# Altium schematic sheet main.SchDoc: WULPUS PRO
size A4; CompanyName: ETH Zurich; DrawnBy: Sergei Vostrikov; Organization: Integrated Systems Laboratory; Revision: 1.0.0; SheetNumber: 1; SheetTotal: 8
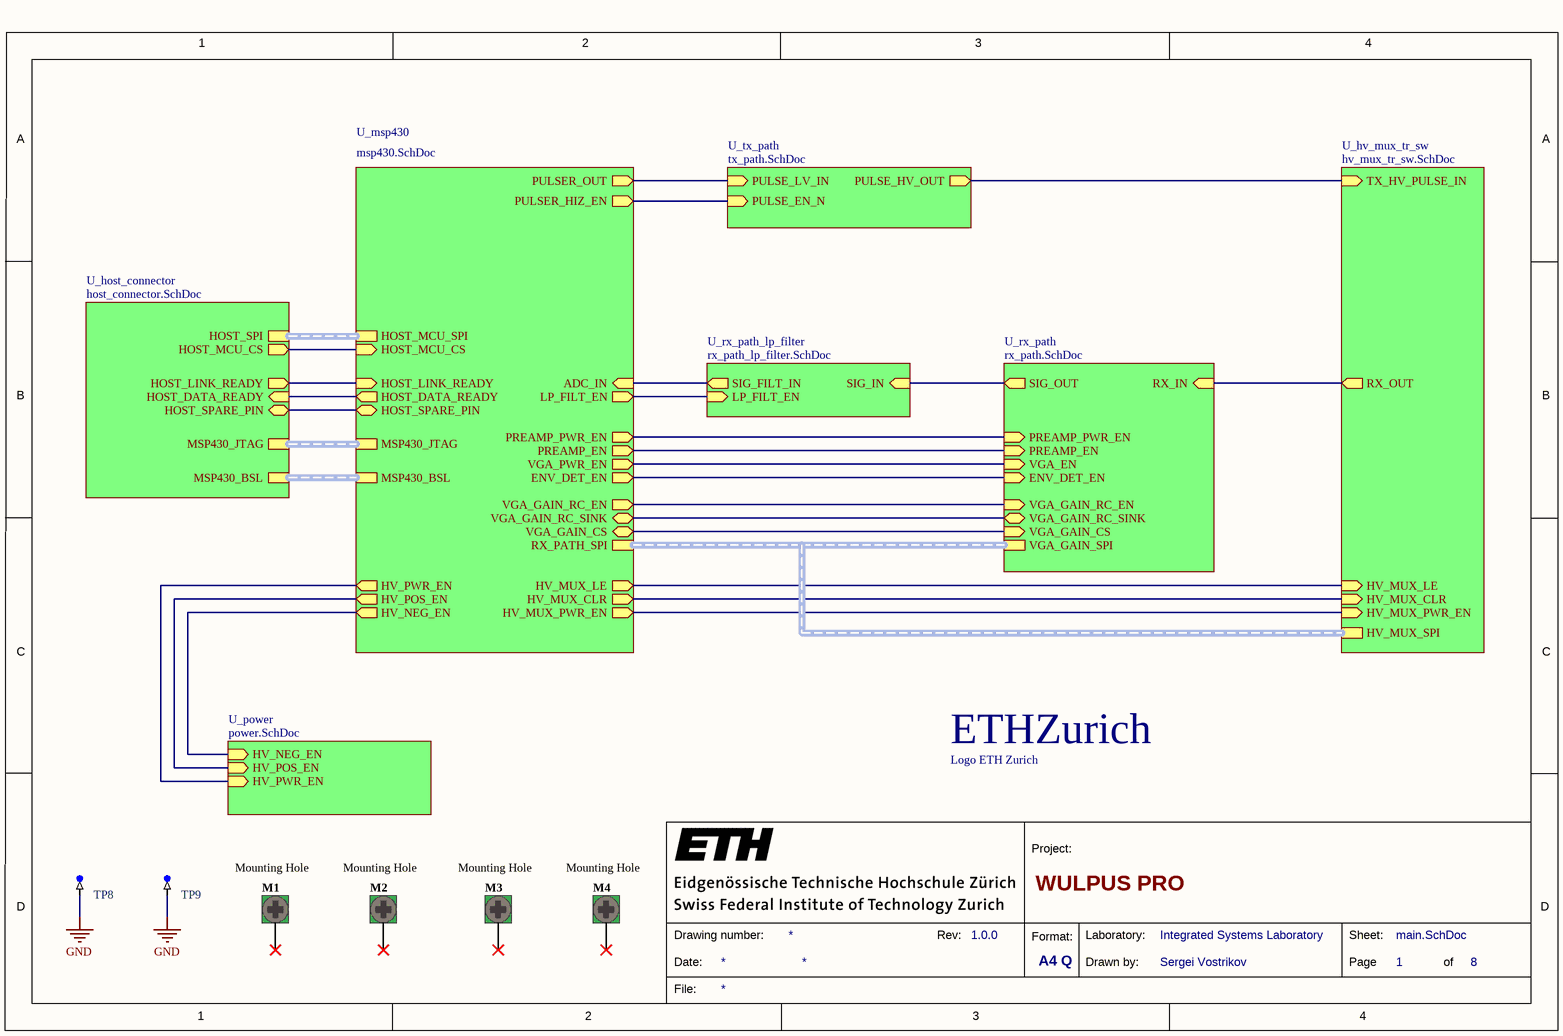
[diagram p0: main.SchDoc]

## Parts
A1  Logo ETH Zurich  [eth-zurich_3mm]  (no BOM)
M1  Mounting Hole  [Mounting Hole]  (no BOM)
M2  Mounting Hole  [Mounting Hole]  (no BOM)
M3  Mounting Hole  [Mounting Hole]  (no BOM)
M4  Mounting Hole  [Mounting Hole]  (no BOM)
TP8  TP-SM-C-100  [TP-SM-C-100]  (value not drawn)  (no BOM)
TP9  TP-SM-C-100  [TP-SM-C-100]  (value not drawn)  (no BOM)

## Sub-sheets
U_host_connector = host_connector.SchDoc: HOST_SPI (harness SPI), HOST_MCU_CS (out), HOST_DATA_READY (in), HOST_LINK_READY (out), HOST_SPARE_PIN (bidir), MSP430_JTAG (harness JTAG), MSP430_BSL (harness BSL_UART)
U_hv_mux_tr_sw = hv_mux_tr_sw.SchDoc: HV_MUX_SPI (harness SPI), HV_MUX_LE (in), HV_MUX_CLR (in), RX_OUT (out), HV_MUX_PWR_EN (in), TX_HV_PULSE_IN (in)
U_msp430 = msp430.SchDoc: ADC_IN (in), PULSER_OUT (out), RX_PATH_SPI (harness SPI), HV_MUX_CLR (out), HV_MUX_LE (out), PREAMP_PWR_EN (out), HOST_DATA_READY (out), HV_MUX_PWR_EN (out), HV_POS_EN (out), HV_NEG_EN (out), HV_PWR_EN (out), HOST_MCU_SPI (harness SPI), HOST_LINK_READY (in), VGA_PWR_EN (out), ENV_DET_EN (out), PULSER_HIZ_EN (out), VGA_GAIN_RC_EN (out), VGA_GAIN_RC_SINK (bidir), VGA_GAIN_CS (bidir), PREAMP_EN (out), HOST_MCU_CS (in), HOST_SPARE_PIN (bidir), MSP430_JTAG (harness JTAG), LP_FILT_EN (out), MSP430_BSL (harness BSL_UART)
U_power = power.SchDoc: HV_PWR_EN (in), HV_POS_EN (in), HV_NEG_EN (in)
U_rx_path = rx_path.SchDoc: VGA_GAIN_RC_EN (in), VGA_GAIN_RC_SINK (bidir), RX_IN (in), SIG_OUT (out), VGA_GAIN_SPI (harness SPI), VGA_GAIN_CS (in), ENV_DET_EN (in), VGA_EN (in), PREAMP_EN (in), PREAMP_PWR_EN (in)
U_rx_path_lp_filter = rx_path_lp_filter.SchDoc: LP_FILT_EN (in), SIG_IN (in), SIG_FILT_IN (out)
U_tx_path = tx_path.SchDoc: PULSE_EN_N (in), PULSE_LV_IN (in), PULSE_HV_OUT (out)

## Nets
GND: TP8.1 TP9.1
(unnamed): sheet U_rx_path/VGA_GAIN_RC_EN, sheet U_msp430/VGA_GAIN_RC_EN
(unnamed): sheet U_rx_path/VGA_GAIN_RC_SINK, sheet U_msp430/VGA_GAIN_RC_SINK
(unnamed): sheet U_rx_path/RX_IN, sheet U_hv_mux_tr_sw/RX_OUT
(unnamed): sheet U_rx_path/SIG_OUT, sheet U_rx_path_lp_filter/SIG_IN
(unnamed): sheet U_rx_path/VGA_GAIN_CS, sheet U_msp430/VGA_GAIN_CS
(unnamed): sheet U_rx_path/ENV_DET_EN, sheet U_msp430/ENV_DET_EN
(unnamed): sheet U_rx_path/VGA_EN, sheet U_msp430/VGA_PWR_EN
(unnamed): sheet U_rx_path/PREAMP_EN, sheet U_msp430/PREAMP_EN
(unnamed): sheet U_rx_path/PREAMP_PWR_EN, sheet U_msp430/PREAMP_PWR_EN
(unnamed): sheet U_rx_path_lp_filter/LP_FILT_EN, sheet U_msp430/LP_FILT_EN
(unnamed): sheet U_rx_path_lp_filter/SIG_FILT_IN, sheet U_msp430/ADC_IN
(unnamed): sheet U_tx_path/PULSE_EN_N, sheet U_msp430/PULSER_HIZ_EN
(unnamed): sheet U_tx_path/PULSE_LV_IN, sheet U_msp430/PULSER_OUT
(unnamed): sheet U_tx_path/PULSE_HV_OUT, sheet U_hv_mux_tr_sw/TX_HV_PULSE_IN
(unnamed): sheet U_hv_mux_tr_sw/HV_MUX_LE, sheet U_msp430/HV_MUX_LE
(unnamed): sheet U_hv_mux_tr_sw/HV_MUX_CLR, sheet U_msp430/HV_MUX_CLR
(unnamed): sheet U_hv_mux_tr_sw/HV_MUX_PWR_EN, sheet U_msp430/HV_MUX_PWR_EN
(unnamed): sheet U_msp430/HOST_DATA_READY, sheet U_host_connector/HOST_DATA_READY
(unnamed): sheet U_msp430/HV_POS_EN, sheet U_power/HV_POS_EN
(unnamed): sheet U_msp430/HV_NEG_EN, sheet U_power/HV_NEG_EN
(unnamed): sheet U_msp430/HV_PWR_EN, sheet U_power/HV_PWR_EN
(unnamed): sheet U_msp430/HOST_LINK_READY, sheet U_host_connector/HOST_LINK_READY
(unnamed): sheet U_msp430/HOST_MCU_CS, sheet U_host_connector/HOST_MCU_CS
(unnamed): sheet U_msp430/HOST_SPARE_PIN, sheet U_host_connector/HOST_SPARE_PIN

Not connected (* = marked no-connect by the designer): M1 1*; M2 1*; M3 1*; M4 1*

## Buses and harness runs
harness sheet U_host_connector/HOST_SPI = sheet U_msp430/HOST_MCU_SPI
harness sheet U_host_connector/MSP430_BSL = sheet U_msp430/MSP430_BSL
harness sheet U_host_connector/MSP430_JTAG = sheet U_msp430/MSP430_JTAG
harness sheet U_hv_mux_tr_sw/HV_MUX_SPI = sheet U_msp430/RX_PATH_SPI = sheet U_rx_path/VGA_GAIN_SPI

## Notes on the sheet
- 1
- 2
- 3
- 4
- A
- B
- C
- Project:
- D
- Date:
- Drawing number:
- Rev:
- Format:
- A4 Q
- Drawn by:
- Laboratory:
- Page
- Sheet:
- of
- File:
- (in symbol CMP-00038-1) ETHZurich

## Library data of the parts
A1 = CMP-00038-1
M1-M4 = CMP-00274-1: M2 Hole, 2.4mm drill, 5mm landing pads, 3mm pad in middle layers, no overlay; ClassName: Mounting Hole
TP8 TP9 = CMP-0484-00002-1: Test Point, Surface Mount, Circular, Pad Diameter 1 mm